# Altium schematic sheet Sheet1.SchDoc
size A4
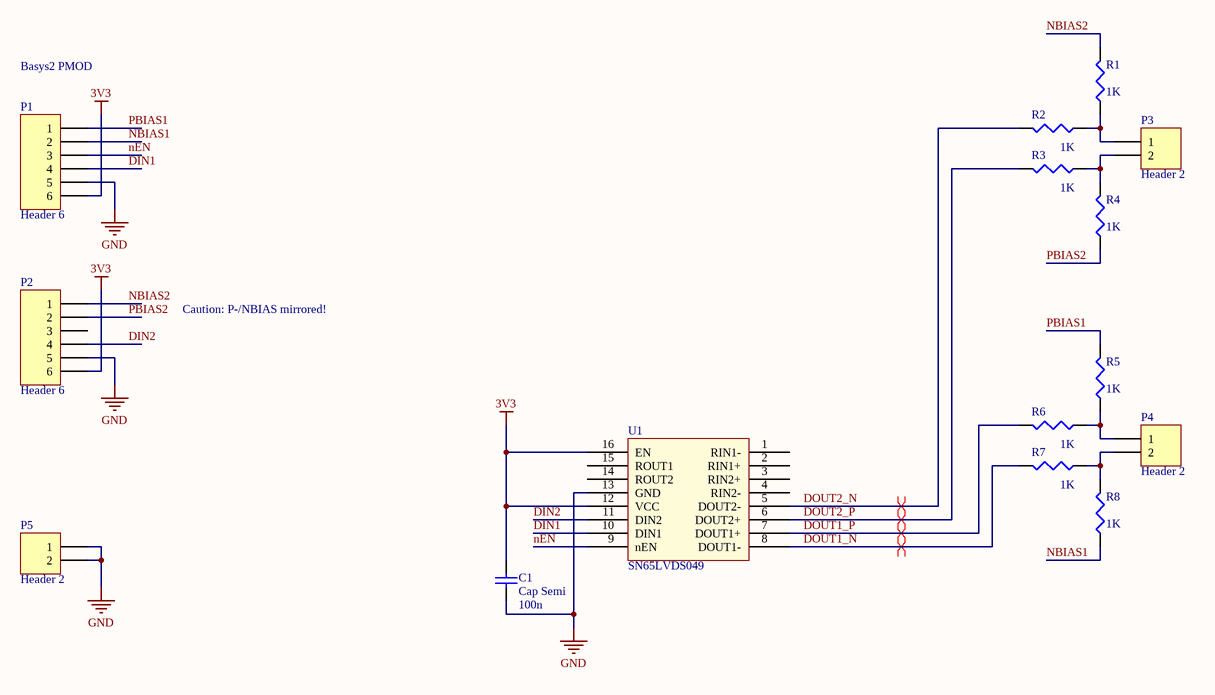
[diagram p0: Sheet1.SchDoc]

## Parts
C1  Cap Semi  value 100n  [1608[0603]]
P1  Header 6  [HDR1X6]
P2  Header 6  [HDR1X6]
P3  Header 2  [HDR1X2]
P4  Header 2  [HDR1X2]
P5  Header 2  [HDR1X2]
R1  value 1K  [J1-0603]  (hidden comment: Res3)
R2  value 1K  [J1-0603]  (hidden comment: Res3)
R3  value 1K  [J1-0603]  (hidden comment: Res3)
R4  value 1K  [J1-0603]  (hidden comment: Res3)
R5  value 1K  [J1-0603]  (hidden comment: Res3)
R6  value 1K  [J1-0603]  (hidden comment: Res3)
R7  value 1K  [J1-0603]  (hidden comment: Res3)
R8  value 1K  [J1-0603]  (hidden comment: Res3)
U1  SN65LVDS049  [SOP127P600-8N]

## Nets
3V3: C1.2 P1.6 P2.6 U1.12(VCC) U1.16(EN)
GND: C1.1 P1.5 P2.5 P5.1 P5.2 U1.13(GND)
DIN1: P1.4 U1.10(DIN1)
DIN2: P2.4 U1.11(DIN2)
DOUT1_N: R7.2 U1.8(DOUT1-)
DOUT1_P: R6.2 U1.7(DOUT1+)
DOUT2_N: R2.2 U1.5(DOUT2-)
DOUT2_P: R3.2 U1.6(DOUT2+)
NBIAS1: P1.2 R8.1
NBIAS2: P2.1 R1.2
nEN: P1.3 U1.9(nEN)
PBIAS1: P1.1 R5.2
PBIAS2: P2.2 R4.1
NetP3_1: P3.1 R1.1 R2.1
NetP3_2: P3.2 R3.1 R4.2
NetP4_1: P4.1 R5.1 R6.1
NetP4_2: P4.2 R7.1 R8.2

Not connected (* = marked no-connect by the designer): P2 3; U1 1(RIN1-) 2(RIN1+) 3(RIN2+) 4(RIN2-) 14(ROUT2) 15(ROUT1)

## Layout directives
differential pair: DOUT1_N, DOUT1_P, DOUT2_N, DOUT2_P

## Notes on the sheet
- Basys2 PMOD
- Caution: P-/NBIAS mirrored!

## Library data of the parts
C1 = Cap Semi: Capacitor (Semiconductor SIM Model); Published: 8-Jun-2000; LatestRevisionDate: 29-May-2009; LatestRevisionNote: IPC-7351 Footprint Added.; PackageReference: C1206; Publisher: Altium Limited; PackageDescription: Chip Capacitor
P1 P2 = Header 6: Header, 6-Pin; LatestRevisionDate: 17-Jul-2002; LatestRevisionNote: Re-released for DXP Platform.; Publisher: Altium Limited
P3-P5 = Header 2: Header, 2-Pin; LatestRevisionDate: 17-Jul-2002; LatestRevisionNote: Re-released for DXP Platform.; Publisher: Altium Limited
R1-R8 = Res3: Resistor; Published: 8-Jun-2000; LatestRevisionDate: 29-May-2009; LatestRevisionNote: IPC-7351 Footprint Added.; PackageReference: J1-0603; Publisher: Altium Limited; PackageDescription: Chip Resistor